# Altium project MainBoard.PrjPCB (part 2 of 2)

## Sheet Mainboard_Debug_Interface.SchDoc
size A4
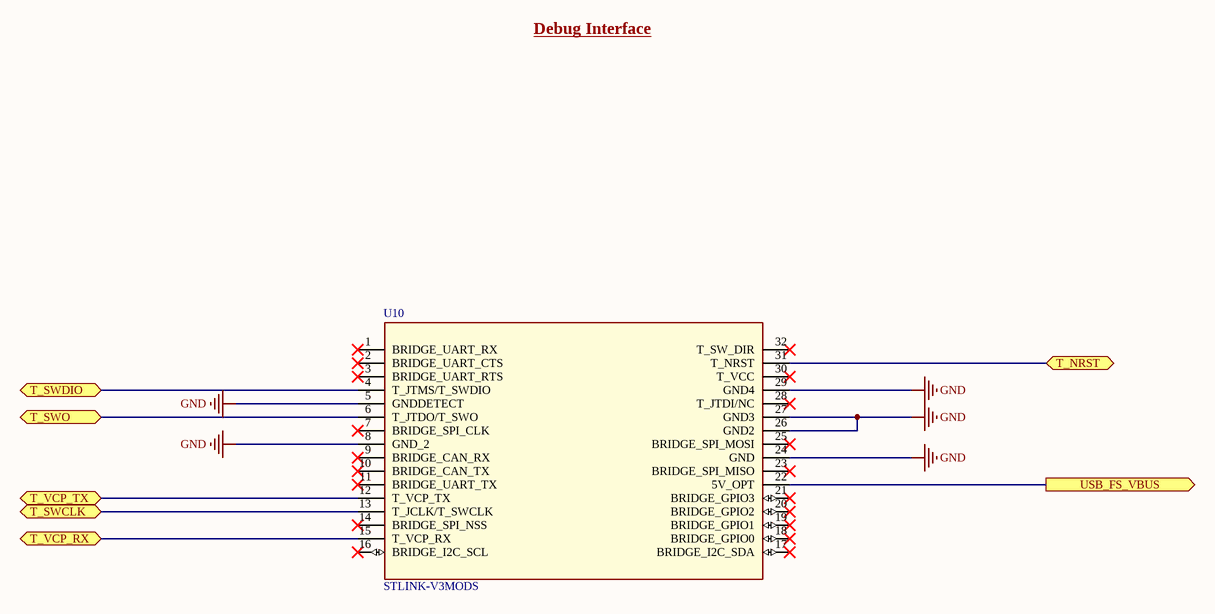
[diagram p7: Mainboard_Debug_Interface.SchDoc]

### Parts
U10  STLINK-V3MODS  [STLINK-V3MODS]

### Ports
T_NRST (bidir), T_SWCLK (bidir), T_SWDIO (bidir), T_SWO (bidir), T_VCP_RX (bidir), T_VCP_TX (bidir), USB_FS_VBUS (out)

### Nets
GND: U10.5(GNDDETECT) U10.8(GND_2) U10.24(GND) U10.26(GND2) U10.27(GND3) U10.29(GND4)
NRST: U10.31(T_NRST) ; port T_NRST
NetF1_1: U10.22(5V_OPT) ; port USB_FS_VBUS
NetU10_4: U10.4(T_JTMS/T_SWDIO) ; port T_SWDIO
NetU10_6: U10.6(T_JTDO/T_SWO) ; port T_SWO
NetU10_12: U10.12(T_VCP_TX) ; port T_VCP_TX
NetU10_13: U10.13(T_JCLK/T_SWCLK) ; port T_SWCLK
NetU10_15: U10.15(T_VCP_RX) ; port T_VCP_RX

Not connected (* = marked no-connect by the designer): U10 1(BRIDGE_UART_RX)* 2(BRIDGE_UART_CTS)* 3(BRIDGE_UART_RTS)* 7(BRIDGE_SPI_CLK)* 9(BRIDGE_CAN_RX)* 10(BRIDGE_CAN_TX)* 11(BRIDGE_UART_TX)* 14(BRIDGE_SPI_NSS)* 16(BRIDGE_I2C_SCL)* 17(BRIDGE_I2C_SDA)* 18(BRIDGE_GPIO0)* 19(BRIDGE_GPIO1)* 20(BRIDGE_GPIO2)* 21(BRIDGE_GPIO3)* 23(BRIDGE_SPI_MISO)* 25(BRIDGE_SPI_MOSI)* 28(T_JTDI/NC)* 30(T_VCC)* 32(T_SW_DIR)*

### Notes on the sheet
- Debug Interface

### Library data of the parts
U10 = STLINK-V3MODS: STM32 - Debugger, Programmer (In-Circuit/In-System); MF: STMicroelectronics; MP: STLINK-V3MODS; Price: $12.15; ComponentLink1Description: Digikey; ComponentLink1URL: https://www.digikey.ca/en/products/detail/stmicroelectronics/stlink-v3mods/11610874; ComponentLink2Description: SnapEDA; ComponentLink2URL: https://www.snapeda.com/parts/STLINK-V3MODS/STMicroelectronics/view-part/; ComponentLink3Description: Datasheet; ComponentLink3URL: https://www.st.com/resource/en/data_brief/stlink-v3mods.pdf; Digikey PN: 497-STLINK-V3MODS-ND

## Sheet Mainboard_User_Interface.SchDoc
size A4
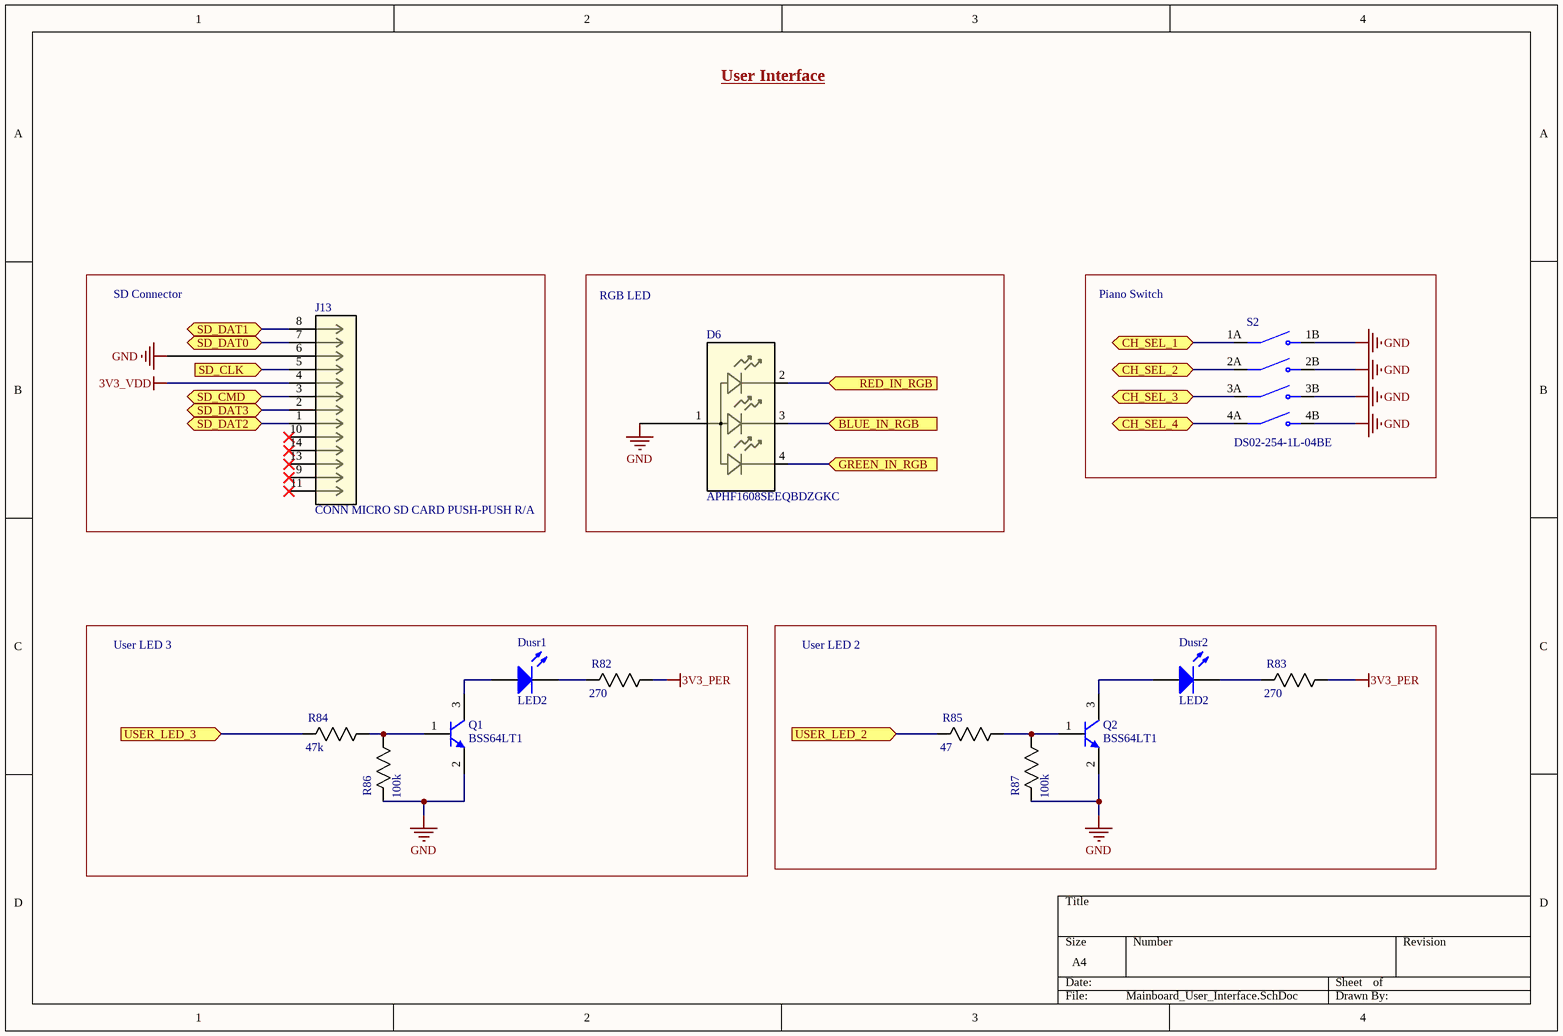
[diagram p8: Mainboard_User_Interface.SchDoc]

### Parts
D6  APHF1608SEEQBDZGKC  [LED RGB APHF1608SEEQBDZGKC_KNB-L]
Dusr1  LED2  [3.2X1.6X1.1]
Dusr2  LED2  [3.2X1.6X1.1]
J13  CONN MICRO SD CARD PUSH-PUSH R/A  [SD Connector 5027740891]
Q1  BSS64LT1  [ONSC-SOT-23-3-318-08_V]
Q2  BSS64LT1  [ONSC-SOT-23-3-318-08_V]
R82  270  [0805]
R83  270  [0805]
R84  47k  [0805]
R85  47  [0805]
R86  100k  [0805]
R87  100k  [0805]
S2  DS02-254-1L-04BE  [SW_DS02-254-1L-04BE]

### Blocks framed on the sheet
SD Connector: J13
RGB LED: D6
Piano Switch: S2
User LED 3: Dusr1 Q1 R82 R84 R86
User LED 2: Dusr2 Q2 R83 R85 R87

### Ports
BLUE_IN_RGB (in), CH_SEL_1 (bidir), CH_SEL_2 (bidir), CH_SEL_3 (bidir), CH_SEL_4 (bidir), GREEN_IN_RGB (in), RED_IN_RGB (in), SD_CLK (in), SD_CMD (bidir), SD_DAT0 (bidir), SD_DAT1 (bidir), SD_DAT2 (bidir), SD_DAT3 (bidir), USER_LED_2 (in), USER_LED_3 (in)

### Nets
3V3_PER: R82.1(R1) R83.1(R1)
3V3_VDD: J13.4
GND: D6.1 J13.6 Q1.2(E) Q2.2(E) R86.2(R2) R87.2(R2) S2.1B(NO1) S2.2B(NO2) S2.3B(NO3) S2.4B(NO4)
NetD6_2: D6.2 ; port RED_IN_RGB
NetD6_3: D6.3 ; port BLUE_IN_RGB
NetD6_4: D6.4 ; port GREEN_IN_RGB
NetDusr1_1: Dusr1.1(A) Q1.3(C)
NetDusr1_2: Dusr1.2(K) R82.2(R2)
NetDusr2_1: Dusr2.1(A) Q2.3(C)
NetDusr2_2: Dusr2.2(K) R83.2(R2)
NetJ13_1: J13.1 ; port SD_DAT2
NetJ13_2: J13.2 ; port SD_DAT3
NetJ13_3: J13.3 ; port SD_CMD
NetJ13_5: J13.5 ; port SD_CLK
NetJ13_7: J13.7 ; port SD_DAT0
NetJ13_8: J13.8 ; port SD_DAT1
NetQ1_1: Q1.1(B) R84.1(R1) R86.1(R1)
NetQ2_1: Q2.1(B) R85.1(R1) R87.1(R1)
NetR84_2: R84.2(R2) ; port USER_LED_3
NetR85_2: R85.2(R2) ; port USER_LED_2
NetS2_1A: S2.1A(COM1) ; port CH_SEL_1
NetS2_2A: S2.2A(COM2) ; port CH_SEL_2
NetS2_3A: S2.3A(COM3) ; port CH_SEL_3
NetS2_4A: S2.4A(COM4) ; port CH_SEL_4

Not connected (* = marked no-connect by the designer): J13 9* 10* 11* 13* 14*

### Notes on the sheet
- User Interface

### Library data of the parts
D6 = LED RGB CLEAR 4SMD: Red, Green, Blue (RGB) 621nm Red, 525nm Green, 465nm Blue LED Indication - Discrete 2V Red, 3.3V Green, 3.3V Blue 4-SMD, No Lead; MF: Kingbright; ComponentLink1Description: Digikey; ComponentLink1URL: https://www.digikey.com/en/products/detail/kingbright/APHF1608SEEQBDZGKC/7597099; Digikey: 754-2144-1-ND; MP: APHF1608SEEQBDZGKC; ComponentLink2Description: Datasheet; ComponentLink2URL: https://www.kingbrightusa.com/images/catalog/SPEC/APHF1608SEEQBDZGKC.pdf
Dusr1 = LED RED SMD: Typical RED, GREEN, YELLOW, AMBER GaAs LED; Lens Color: Colorless; Voltage - Forward (Vf) (Typ): 1.7V; Current - Test: 20mA; Lens Transparency: Clear; Package: 1206; Color: Red
Dusr2 = LED GREEN SMD: Typical RED, GREEN, YELLOW, AMBER GaAs LED; Voltage - Forward (Vf) (Typ): 2V; Lens Transparency: Clear; Current - Test: 20mA; Package: 1206; Color: Green
J13 = CONN MICRO SD CARD PUSH-PUSH R/A: 10 (8 + 2) Position Card Connector Secure Digital - microSD™ Surface Mount, Right Angle Gold; MF: Molex; MP: 5027740891; ComponentLink1Description: Digikey; ComponentLink1URL: https://www.digikey.ca/en/products/detail/molex/5027740891/1952536; Digikey: WM24066CT-ND; ComponentLink2Description: Datasheet; ComponentLink2URL: https://www.molex.com/pdm_docs/sd/5027740891_sd.pdf
Q1 Q2 = CMP-1048-00605-1: Driver Transistor, NPN Silicon, 3-Pin SOT-23, Tape and Reel; Manufacturer: On Semiconductor; IC Continuous (A): 0.1; fT Min (MHz): 60; ComponentLink1Description: Manufacturer URL; ComponentLink3Description: Package Specification; ComponentLink2URL: http://www.onsemi.com/pub_link/Collateral/BSS64LT1-D.PDF; ComponentLink1URL: http://www.onsemi.com/; ComponentLink2Description: Datasheet; ComponentLink3URL: http://www.onsemi.cn/pub_link/Collateral/318-08.PDF; RoHS: FALSE; PackageVersion: Rev. AP, 11/2009; Polarity: NPN; PartNumber: BSS64LT1; Mounting Technology: Surface Mount; PackageDescription: 3-Pin Small Outline Transistor, Body 2.92 x 1.3 mm, Pitch 0.95 mm; Packing: Tape and Reel; DatasheetVersion: Rev. 5; PackageReference: SOT-23-3-318-08
R82 R83 = RES 270.0 1/8W: RES SMD 270 OHM 5% 1/8W 0805; Power (Watts): 0.125W; Package: 0805; Value: 270; Tolerance: 5%
R84 = RES 47k 1/8W - 1%: RES SMD 47K OHM 1% 1/8W 0805; Power (Watts): 0.125W; Package: 0805; Value: 47k; Tolerance: 1%
R85 = RES 47.0 1/8W - 1%: RES SMD 47 OHM 1% 1/8W 0805; Power (Watts): 0.125W; Package: 0805; Value: 47; Tolerance: 1%
R86 R87 = RES 100k 1/8W - 1%: RES SMD 100K OHM 1% 1/8W 0805; Power (Watts): 0.125W; Package: 0805; Value: 100k; Tolerance: 1%
S2 = DS02-254-1L-04BE: Dip Switch Piano Key 4-position; Package: None; Price: None; Value: *; MP: DS02-254-1L-04BE; Availability: Unavailable

## Sheet Mainboard_MCU_Breakout.SchDoc
size A4
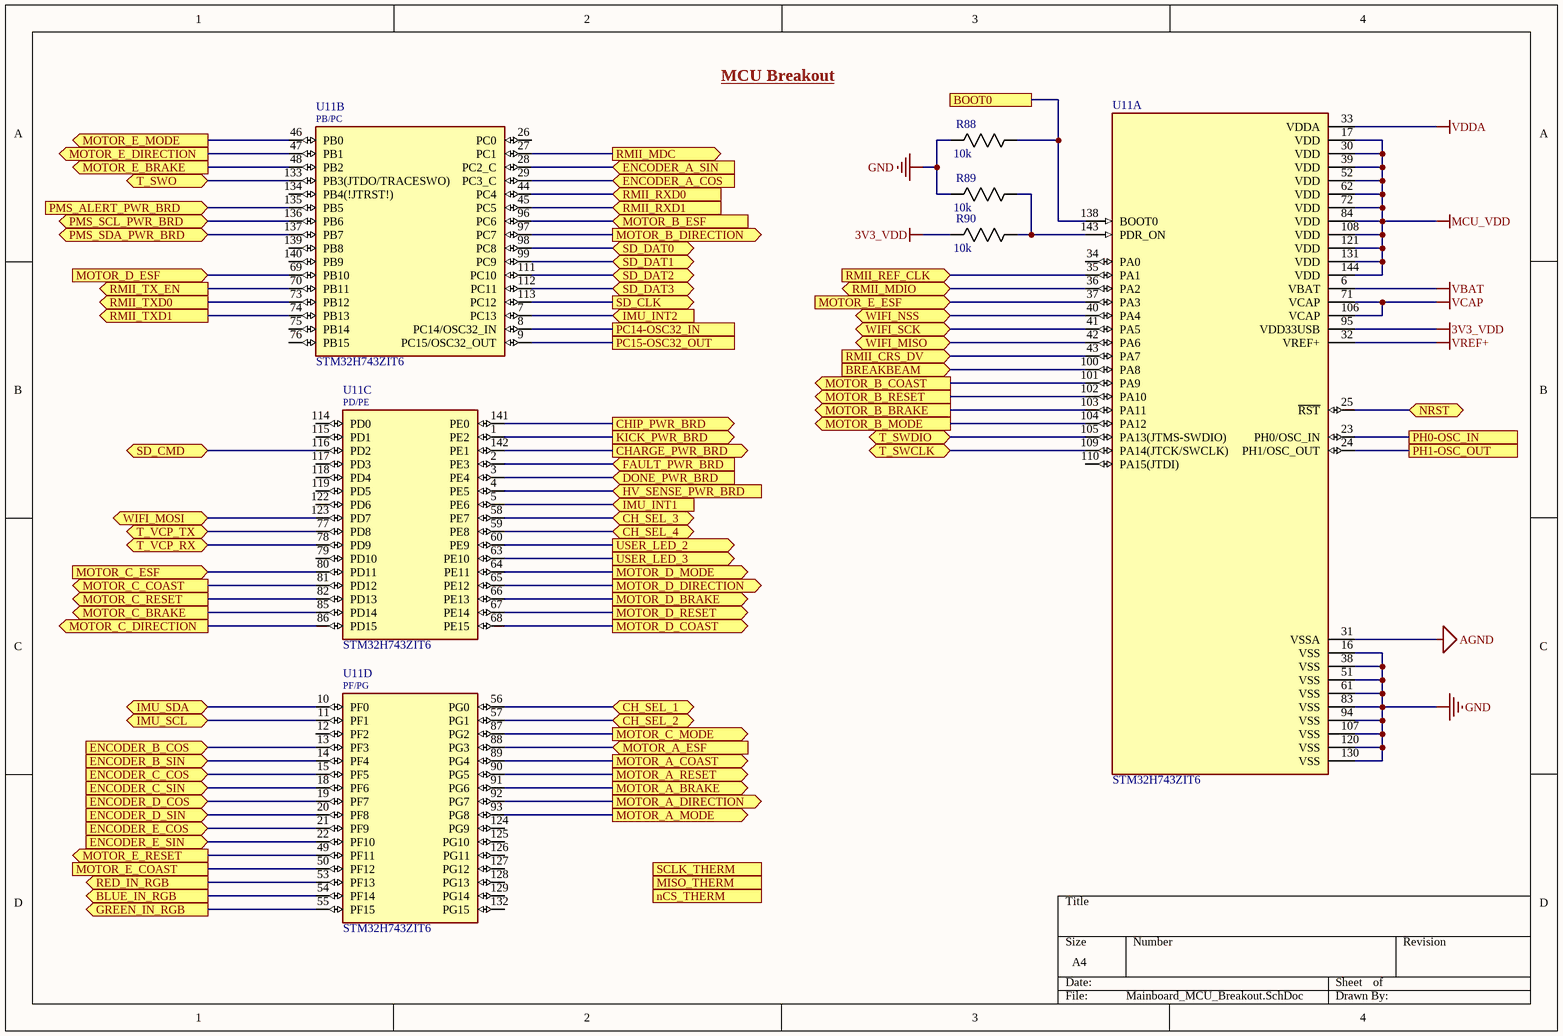
[diagram p9: Mainboard_MCU_Breakout.SchDoc]

### Parts
R88  10k  [0805]
R89  10k  [0805]
R90  10k  [0805]
U11  STM32H743ZIT6  [QFP50P2200X2200X160-144N]  (parts A,B,C,D of 4)

### Ports
BLUE_IN_RGB (out), BOOT0, BREAKBEAM (in), CH_SEL_1 (bidir), CH_SEL_2 (bidir), CH_SEL_3 (bidir), CH_SEL_4 (bidir), CHARGE_PWR_BRD (out), CHIP_PWR_BRD (out), DONE_PWR_BRD (in), ENCODER_A_COS (in), ENCODER_A_SIN (in), ENCODER_B_COS (in), ENCODER_B_SIN (in), ENCODER_C_COS (in), ENCODER_C_SIN (in), ENCODER_D_COS (in), ENCODER_D_SIN (in), ENCODER_E_COS (in), ENCODER_E_SIN (in), FAULT_PWR_BRD (in), GREEN_IN_RGB (out), HV_SENSE_PWR_BRD (in), IMU_INT1 (in), IMU_INT2 (in), IMU_SCL (bidir), IMU_SDA (bidir), KICK_PWR_BRD (out), MISO_THERM (in), MOTOR_A_BRAKE (out), MOTOR_A_COAST (out), MOTOR_A_DIRECTION (out), MOTOR_A_ESF (in), MOTOR_A_MODE (out), MOTOR_A_RESET (out), MOTOR_B_BRAKE (out), MOTOR_B_COAST (out), MOTOR_B_DIRECTION (out), MOTOR_B_ESF (in), MOTOR_B_MODE (out), MOTOR_B_RESET (out), MOTOR_C_BRAKE (out), MOTOR_C_COAST (out), MOTOR_C_DIRECTION (out), MOTOR_C_ESF (in), MOTOR_C_MODE (out), MOTOR_C_RESET (out), MOTOR_D_BRAKE (out), MOTOR_D_COAST (out), MOTOR_D_DIRECTION (out), MOTOR_D_ESF (in), MOTOR_D_MODE (out), MOTOR_D_RESET (out), MOTOR_E_BRAKE (out), MOTOR_E_COAST, MOTOR_E_DIRECTION (out), MOTOR_E_ESF (in), MOTOR_E_MODE (out), MOTOR_E_RESET (out), nCS_THERM (out), NRST (bidir), PC14-OSC32_IN, PC15-OSC32_OUT, PH0-OSC_IN, PH1-OSC_OUT, PMS_ALERT_PWR_BRD (in), PMS_SCL_PWR_BRD (bidir), PMS_SDA_PWR_BRD (bidir), RED_IN_RGB (out), RMII_CRS_DV (in), RMII_MDC (out), RMII_MDIO (bidir), RMII_REF_CLK (in), RMII_RXD0 (in), RMII_RXD1 (in), RMII_TX_EN (out), RMII_TXD0 (out), RMII_TXD1 (out), SCLK_THERM (out), SD_CLK (out), SD_CMD (bidir), SD_DAT0 (bidir), SD_DAT1 (bidir), SD_DAT2 (bidir), SD_DAT3 (bidir), T_SWCLK (bidir), T_SWDIO (bidir), T_SWO (bidir), T_VCP_RX (bidir), T_VCP_TX (bidir), USER_LED_2 (out), USER_LED_3 (out), WIFI_MISO (bidir), WIFI_MOSI (bidir), WIFI_NSS (bidir), WIFI_SCK (bidir)

### Nets
3V3_VDD: R90.2(R2) U11.95(VDD33USB)
AGND: U11.31(VSSA)
GND: R88.2(R2) R89.2(R2) U11.16(VSS) U11.38(VSS) U11.51(VSS) U11.61(VSS) U11.83(VSS) U11.94(VSS) U11.107(VSS) U11.120(VSS) U11.130(VSS)
MCU_VDD: U11.17(VDD) U11.30(VDD) U11.39(VDD) U11.52(VDD) U11.62(VDD) U11.72(VDD) U11.84(VDD) U11.108(VDD) U11.121(VDD) U11.131(VDD) U11.144(VDD)
VBAT: U11.6(VBAT)
VCAP: U11.71(VCAP) U11.106(VCAP)
VDDA: U11.33(VDDA)
VREF+: U11.32(VREF+)
Cos1: U11.13(PF3) ; port ENCODER_B_COS
Cos2: U11.29(PC3_C) ; port ENCODER_A_COS
Cos3: U11.15(PF5) ; port ENCODER_C_COS
Cos4: U11.19(PF7) ; port ENCODER_D_COS
NRST: U11.25(~{RST}) ; port NRST
PC14-OSC32_IN: U11.8(PC14/OSC32_IN) ; port PC14-OSC32_IN
PC15-OSC32_OUT: U11.9(PC15/OSC32_OUT) ; port PC15-OSC32_OUT
PH0-OSC_IN: U11.23(PH0/OSC_IN) ; port PH0-OSC_IN
PH1-OSC_OUT: U11.24(PH1/OSC_OUT) ; port PH1-OSC_OUT
RMII_MDIO: U11.36(PA2) ; port RMII_MDIO
RMII_REF_CLK: U11.35(PA1) ; port RMII_REF_CLK
RMII_TX_EN: U11.70(PB11) ; port RMII_TX_EN
RMII_TXD0: U11.73(PB12) ; port RMII_TXD0
RMII_TXD1: U11.74(PB13) ; port RMII_TXD1
Sin1: U11.14(PF4) ; port ENCODER_B_SIN
Sin2: U11.28(PC2_C) ; port ENCODER_A_SIN
Sin3: U11.18(PF6) ; port ENCODER_C_SIN
Sin4: U11.20(PF8) ; port ENCODER_D_SIN
NetD6_2: U11.53(PF13) ; port RED_IN_RGB
NetD6_3: U11.54(PF14) ; port BLUE_IN_RGB
NetD6_4: U11.55(PF15) ; port GREEN_IN_RGB
NetJ7_A17: U11.91(PG6) ; port MOTOR_A_BRAKE
NetJ7_A18: U11.88(PG3) ; port MOTOR_A_ESF
NetJ7_B15: U11.90(PG5) ; port MOTOR_A_RESET
NetJ7_B16: U11.89(PG4) ; port MOTOR_A_COAST
NetJ7_B17: U11.93(PG8) ; port MOTOR_A_MODE
NetJ7_B18: U11.92(PG7) ; port MOTOR_A_DIRECTION
NetJ8_A17: U11.85(PD14) ; port MOTOR_C_BRAKE
NetJ8_A18: U11.80(PD11) ; port MOTOR_C_ESF
NetJ8_B15: U11.82(PD13) ; port MOTOR_C_RESET
NetJ8_B16: U11.81(PD12) ; port MOTOR_C_COAST
NetJ8_B17: U11.87(PG2) ; port MOTOR_C_MODE
NetJ8_B18: U11.86(PD15) ; port MOTOR_C_DIRECTION
NetJ9_A17: U11.48(PB2) ; port MOTOR_E_BRAKE
NetJ9_A18: U11.37(PA3) ; port MOTOR_E_ESF
NetJ9_B15: U11.49(PF11) ; port MOTOR_E_RESET
NetJ9_B16: U11.50(PF12) ; port MOTOR_E_COAST
NetJ9_B17: U11.46(PB0) ; port MOTOR_E_MODE
NetJ9_B18: U11.47(PB1) ; port MOTOR_E_DIRECTION
NetJ10_A17: U11.103(PA11) ; port MOTOR_B_BRAKE
NetJ10_A18: U11.96(PC6) ; port MOTOR_B_ESF
NetJ10_B15: U11.102(PA10) ; port MOTOR_B_RESET
NetJ10_B16: U11.101(PA9) ; port MOTOR_B_COAST
NetJ10_B17: U11.104(PA12) ; port MOTOR_B_MODE
NetJ10_B18: U11.97(PC7) ; port MOTOR_B_DIRECTION
NetJ11_A17: U11.66(PE13) ; port MOTOR_D_BRAKE
NetJ11_A18: U11.69(PB10) ; port MOTOR_D_ESF
NetJ11_B15: U11.67(PE14) ; port MOTOR_D_RESET
NetJ11_B16: U11.68(PE15) ; port MOTOR_D_COAST
NetJ11_B17: U11.64(PE11) ; port MOTOR_D_MODE
NetJ11_B18: U11.65(PE12) ; port MOTOR_D_DIRECTION
NetJ12_2: U11.100(PA8) ; port BREAKBEAM
NetJ13_1: U11.111(PC10) ; port SD_DAT2
NetJ13_2: U11.112(PC11) ; port SD_DAT3
NetJ13_3: U11.116(PD2) ; port SD_CMD
NetJ13_5: U11.113(PC12) ; port SD_CLK
NetJ13_7: U11.98(PC8) ; port SD_DAT0
NetJ13_8: U11.99(PC9) ; port SD_DAT1
NetPboot1_1: R88.1(R1) U11.138(BOOT0) ; port BOOT0
NetPwifi1_3: U11.123(PD7) ; port WIFI_MOSI
NetPwifi1_4: U11.42(PA6) ; port WIFI_MISO
NetPwifi1_5: U11.40(PA4) ; port WIFI_NSS
NetPwifi1_6: U11.41(PA5) ; port WIFI_SCK
NetR63_2: U11.44(PC4) ; port RMII_RXD0
NetR64_2: U11.45(PC5) ; port RMII_RXD1
NetR66_2: U11.43(PA7) ; port RMII_CRS_DV
NetR84_2: U11.63(PE10) ; port USER_LED_3
NetR85_2: U11.60(PE9) ; port USER_LED_2
NetR89_1: R89.1(R1) R90.1(R1) U11.143(PDR_ON)
NetS2_1A: U11.56(PG0) ; port CH_SEL_1
NetS2_2A: U11.57(PG1) ; port CH_SEL_2
NetS2_3A: U11.58(PE7) ; port CH_SEL_3
NetS2_4A: U11.59(PE8) ; port CH_SEL_4
NetU8_13: U11.27(PC1) ; port RMII_MDC
NetU9_4: U11.5(PE6) ; port IMU_INT1
NetU9_9: U11.7(PC13) ; port IMU_INT2
NetU9_13: U11.11(PF1) ; port IMU_SCL
NetU9_14: U11.10(PF0) ; port IMU_SDA
NetU10_4: U11.105(PA13(JTMS-SWDIO)) ; port T_SWDIO
NetU10_6: U11.133(PB3(JTDO/TRACESWO)) ; port T_SWO
NetU10_12: U11.77(PD8) ; port T_VCP_TX
NetU10_13: U11.109(PA14(JTCK/SWCLK)) ; port T_SWCLK
NetU10_15: U11.78(PD9) ; port T_VCP_RX
NetU11_1: U11.1(PE2) ; port KICK_PWR_BRD
NetU11_2: U11.2(PE3) ; port FAULT_PWR_BRD
NetU11_3: U11.3(PE4) ; port DONE_PWR_BRD
NetU11_4: U11.4(PE5) ; port HV_SENSE_PWR_BRD
NetU11_21: U11.21(PF9) ; port ENCODER_E_COS
NetU11_22: U11.22(PF10) ; port ENCODER_E_SIN
NetU11_135: U11.135(PB5) ; port PMS_ALERT_PWR_BRD
NetU11_136: U11.136(PB6) ; port PMS_SCL_PWR_BRD
NetU11_137: U11.137(PB7) ; port PMS_SDA_PWR_BRD
NetU11_141: U11.141(PE0) ; port CHIP_PWR_BRD
NetU11_142: U11.142(PE1) ; port CHARGE_PWR_BRD

Not connected (* = marked no-connect by the designer): U11 12(PF2) 26(PC0) 34(PA0) 75(PB14) 76(PB15) 79(PD10) 110(PA15(JTDI)) 114(PD0) 115(PD1) 117(PD3) 118(PD4) 119(PD5) 122(PD6) 124(PG9) 125(PG10) 126(PG11) 127(PG12) 128(PG13) 129(PG14) 132(PG15) 134(PB4(!JTRST!)) 139(PB8) 140(PB9)

### Notes on the sheet
- MCU Breakout
- (in symbol STM32H743ZIT6, part B) PB/PC
- (in symbol STM32H743ZIT6, part C) PD/PE
- (in symbol STM32H743ZIT6, part D) PF/PG

### Library data of the parts
R88-R90 = RES 10k 1/8W - 1%: RES SMD 10K OHM 1% 1/8W 0805; Power (Watts): 0.125W; Package: 0805; Value: 10k; Tolerance: 1%
U11 = STM32H743ZIT6: ARM® Cortex®-M7 STM32H7 Microcontroller IC 32-Bit 480MHz 2MB (2M x 8) FLASH 144-LQFP (20x20); MF: STMicroelectronics; Package: LQFP-144 STMicroelectronics; MP: STM32H743ZIT6; ComponentLink1Description: SnapEDA; ComponentLink1URL: https://www.snapeda.com/parts/STM32H743ZIT6/STMicroelectronics/view-part/1041111/?ref=snap; ComponentLink2Description: DigiKey; ComponentLink2URL: https://www.digikey.ca/en/products/detail/stmicroelectronics/STM32H743ZIT6/7809238; ComponentLink3Description: Datasheet; ComponentLink3URL: https://www.st.com/resource/en/datasheet/stm32h743bi.pdf; DigiKey PN: 497-17721-ND

## Sheet Mainboard_MCU_Func.SchDoc
size A4
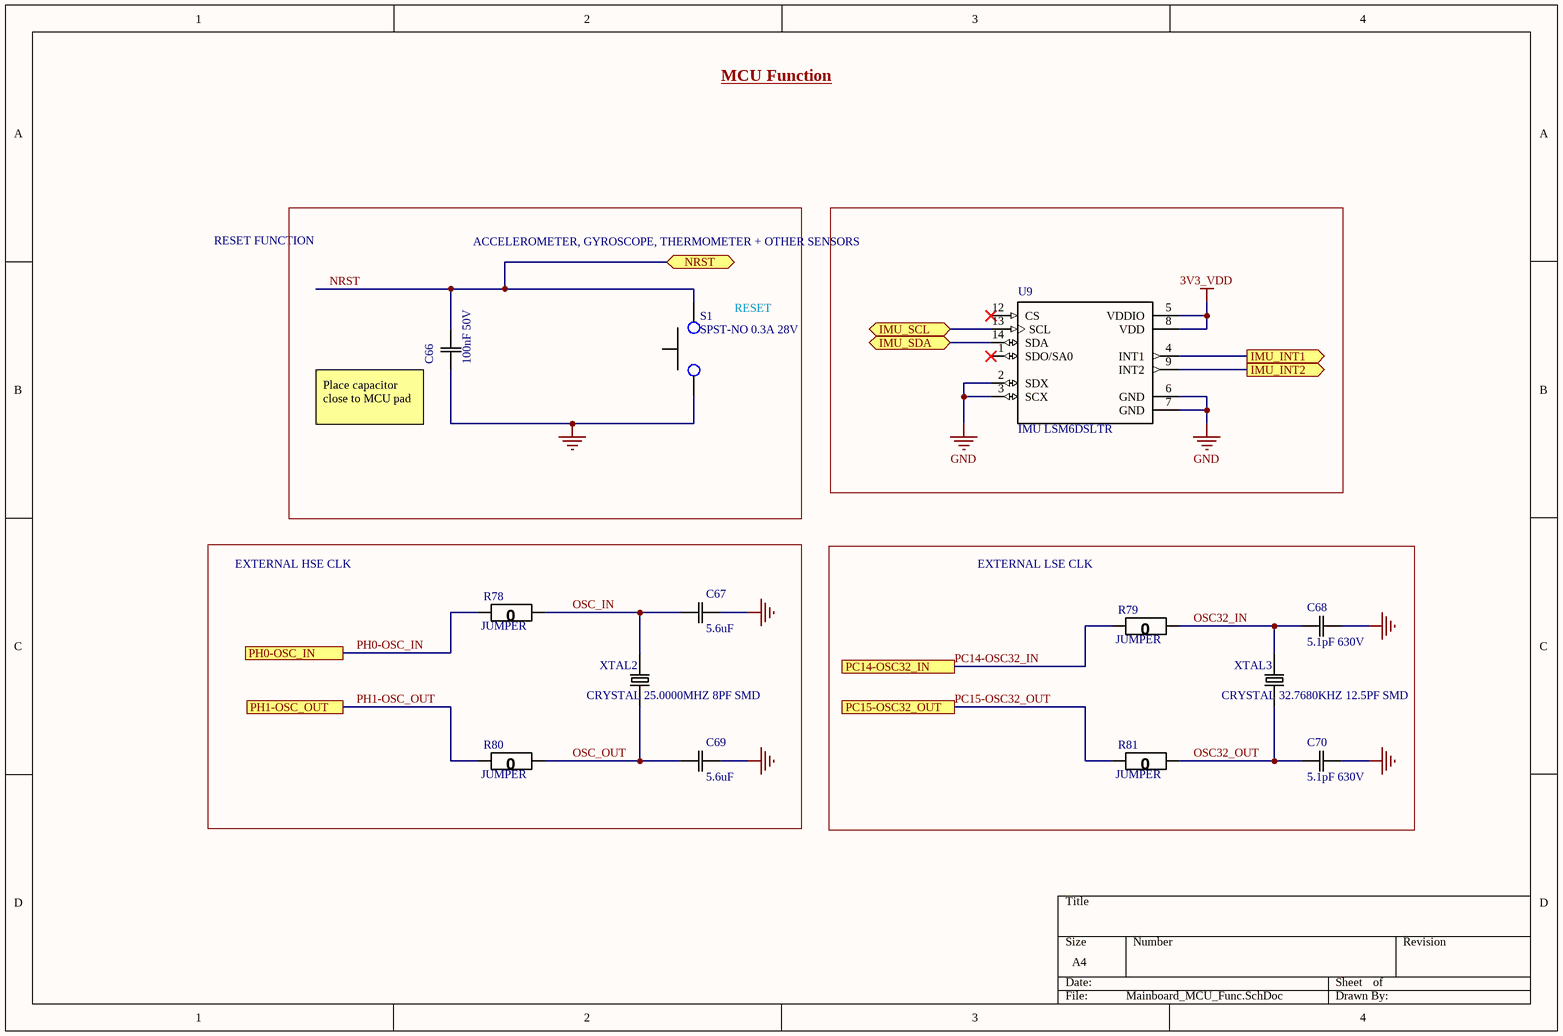
[diagram p10: Mainboard_MCU_Func.SchDoc]

### Parts
C66  100nF 50V  [0805]
C67  5.6uF  [0805]
C68  5.1pF 630V  [0805]
C69  5.6uF  [0805]
C70  5.1pF 630V  [0805]
R78  JUMPER  [0805]
R79  JUMPER  [0805]
R80  JUMPER  [0805]
R81  JUMPER  [0805]
S1  SPST-NO 0.3A 28V  [PB300STQ]
U9  IMU LSM6DSLTR  [LGA-14]
XTAL2  CRYSTAL 25.0000MHZ 8PF SMD  [SMD-2]
XTAL3  CRYSTAL 32.7680KHZ 12.5PF SMD  [SMD-2]

### Blocks framed on the sheet
ACCELEROMETER, GYROSCOPE, THERMOMETER + OTHER SENSORS: U9
EXTERNAL HSE CLK: C67 C69 R78 R80 XTAL2
EXTERNAL LSE CLK: C68 C70 R79 R81 XTAL3

### Ports
IMU_INT1 (out), IMU_INT2 (out), IMU_SCL (bidir), IMU_SDA (bidir), NRST (bidir), PC14-OSC32_IN, PC15-OSC32_OUT, PH0-OSC_IN, PH1-OSC_OUT

### Nets
3V3_VDD: U9.5(VDDIO) U9.8(VDD)
GND: C66.1(C1) C67.2(C2) C68.2(C2) C69.2(C2) C70.2(C2) S1.1 U9.2(SDX) U9.3(SCX) U9.6(GND) U9.7(GND)
NRST: C66.2(C2) S1.2 ; port NRST
OSC32_IN: C68.1(C1) R79.1(R1) XTAL3.2
OSC32_OUT: C70.1(C1) R81.1(R1) XTAL3.1
OSC_IN: C67.1(C1) R78.1(R1) XTAL2.2
OSC_OUT: C69.1(C1) R80.1(R1) XTAL2.1
PC14-OSC32_IN: R79.2(R2) ; port PC14-OSC32_IN
PC15-OSC32_OUT: R81.2(R2) ; port PC15-OSC32_OUT
PH0-OSC_IN: R78.2(R2) ; port PH0-OSC_IN
PH1-OSC_OUT: R80.2(R2) ; port PH1-OSC_OUT
NetU9_4: U9.4(INT1) ; port IMU_INT1
NetU9_9: U9.9(INT2) ; port IMU_INT2
NetU9_13: U9.13(SCL) ; port IMU_SCL
NetU9_14: U9.14(SDA) ; port IMU_SDA

Not connected (* = marked no-connect by the designer): U9 1(SDO/SA0)* 12(CS)*

### Notes on the sheet
- MCU Function
- RESET FUNCTION
- (near S1) RESET
- (near C66) Place capacitor close to MCU pad

### Library data of the parts
C66 = CAP 100nF 50V: CAP CER 0.1UF 50V X7R 0805; Tolerance: 10%; Package: 0805; Value: 100nF; Rating: 50V
C67 C69 = CAP 5.6uF 6.3V: CAP CER 5.6UF 6.3V X5R 0805; Tolerance: 10%; Package: 0805; Value: 5.6uF; Rating: 6.3V; Temperature Coefficient: X5R; Operating Temperature: -55°C ~ 85°C
C68 C70 = CAP 5.1pF 630V: CAP CER 5.1PF 630V C0G/NP0 0805; Tolerance: 10%; Rating: 50V; Package: 0805; Value: 5.1pF; Temperature Coefficient: C0G/NP0; Operating Temperature: -55°C ~ 125°C
R78-R81 = RES 0 JUMPER: RES SMD 0 OHM JUMPER GENERIC 0805; Value: 0; Package: 0805
S1 = SW PUSH NO: Pushbutton Switch SPST-NO Standard Through Hole; MF: E-Switch; Rating: 28V 0.3A; ComponentLink1Description: Digikey; ComponentLink1URL: https://www.digikey.ca/product-detail/en/e-switch/PB300STQ/EG5398-ND/6126493; ComponentLink2Description: Datasheet; ComponentLink2URL: https://sten-eswitch-13110800-production.s3.amazonaws.com/system/asset/product_line/data_sheet/222/PB300.pdf; Digikey: EG5398-ND; Digikey Link: https://www.digikey.ca/product-detail/en/e-switch/PB300STQ/EG5398-ND/6126493; MP: PB300STQ; Price: 3.40000 CAD
U9 = IMU LSM6DSLTR: IMU ACCEL/GYRO I2C/SPI 14LGA; MF: STMicroelectronics; SnapEDA_Link: https://www.snapeda.com/parts/LSM6DSLTR/STMicroelectronics/view-part/550517/?ref=snap; MP: LSM6DSLTR; Package: LGA-14 STMicroelectronics; Digikey: https://www.digikey.ca/product-detail/en/stmicroelectronics/LSM6DSLTR/497-16705-1-ND/6192805; Supplier 1: Digi-Key; Supplier Part Number 1: 497-16705-1-ND
XTAL2 = XTAL 25MHZ 8PF SMD: 25MHz ±50ppm Crystal 8pF 70 Ohms 2-SMD, No Lead; MP: NX5032GA-25.000000MHZ-LN-CD-1; MF: NDK America, Inc.; ESR: 70 Ohms; Package: 2-SMD, No Lead; Price: 0.95 CAD; Frequency: 25MHz; Digikey: 644-1041-1-ND; Digikey Link: https://www.digikey.ca/product-detail/en/ndk-america-inc/NX5032GA-25.000000MHZ-LN-CD-1/644-1041-1-ND/1128913; Load Capacitance: 8pF; Supplier 1: Digi-Key; Supplier Part Number 1: 644-1041-1-ND
XTAL3 = XTAL 32.7680KHZ 12.5PF SMD: 32.768kHz ±20ppm Crystal 12.5pF 70 kOhms 2-SMD, No Lead; MP: NX3215SA-32.768K-STD-MUA-8; MF: NDK America, Inc.; Package: 2-SMD, No Lead; Price: 1.04000 CAD; Frequency: 32.768kHz; Digikey: 644-1156-1-ND; Digikey Link: https://www.digikey.ca/en/products/detail/ndk-america-inc/NX3215SA-32-768K-STD-MUA-8/2261469?s=N4IgTCBcDaIGwBYEFoCMqCsc3IHIBEQBdAXyA; Load Capacitance: 12.5pF; ESR: 70 kOhms; ComponentLink1Description: Digikey; ComponentLink1URL: https://www.digikey.ca/en/products/detail/ndk-america-inc/NX3215SA-32-768K-STD-MUA-8/2261469; ComponentLink2Description: Datasheet; ComponentLink2URL: https://media.digikey.com/datasheets/production/702868/1/NX3215SA-32-768K-STD-MUA-8.html; Supplier 1: Digi-Key; Supplier Part Number 1: 644-1156-1-ND

## Sheet Mainboard_ThermistorAmp.SchDoc
size A
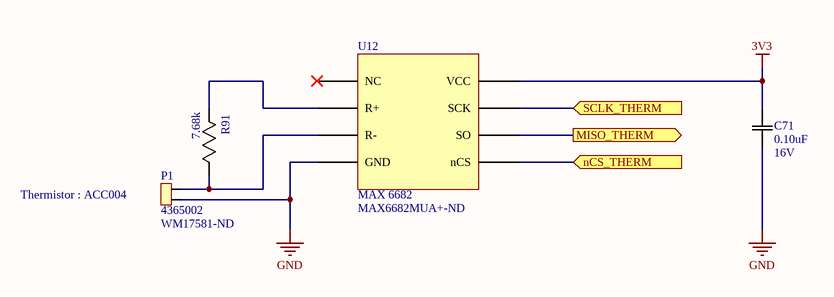
[diagram p11: Mainboard_ThermistorAmp.SchDoc]

### Parts
C71  Rating: 16V  [0603]  (hidden comment: 0.10uF)
P1  4365002  Supplier Part Number 2: WM17581-ND  [43650-02]
R91  7.68k  [0805]
U12  MAX 6682  Supplier Part Number 1: MAX6682MUA+-ND  [8-MSOP]

### Ports
MISO_THERM (out), nCS_THERM (in), SCLK_THERM (in)

### Nets
3V3: C71.1(C1) U12.8(VCC)
GND: C71.2(C2) P1.1 U12.4(GND)
NetP1_2: P1.2 R91.1(R1) U12.3(R-)
NetR91_2: R91.2(R2) U12.2(R+)
NetU12_5: U12.5(nCS) ; port nCS_THERM
NetU12_6: U12.6(SO) ; port MISO_THERM
NetU12_7: U12.7(SCK) ; port SCLK_THERM

Not connected (* = marked no-connect by the designer): U12 1(NC)*

### Notes on the sheet
- (near P1) Thermistor : ACC004

### Library data of the parts
C71 = CAP 0.10uF 16V: CAP CER 0.10UF 16V X5R 0603/0805; Tolerance: 10%; Package: 0603/0805; Temperature Coefficient: X5R; Operating Temperature: -55°C ~ 85°C; Value: 0.10uF
P1 = CN MOLEX 4365002XX: MOLEX MICROFIT 2CKT RIGHT THRU; MF: MOLEX; MP: 4365002XX; Digikey: WM17581-ND; Digikey Link: https://www.digikey.com/en/products/detail/molex/0436500205/3310532?s=N4IgTCBcDaICwGYBsBWADGsaUgLoF8g; Package: Microfit; Price: 1.44 CAD; Value: N/A; Supplier 1: Digi-Key
R91 = RES 7.68k 0.15W: RES SMD 7.68K OHM 0.1% 0.15W 0805; Power (Watts): 0.125W; Tolerance: 5%; Package: 0805; Value: 7.68k
U12 = MAX 6682: MAX 6685 Thermistor - SPI converter, 8bit; Supplier 1: Digi-Key

## Nets that join several sheets
3V3: Mainboard_Encoder_Interface (13 pins), Mainboard_Motordriver_Interface (17 pins), Mainboard_RMII_Interface (8 pins), Mainboard_Wifi_Interface (Pwifi1.7), MainBoard_MCU_Power (5 pins), Mainboard_ThermistorAmp (C71.1 U12.8)
3V3_PER: MainBoard_MCU_Power (R8.1), Mainboard_User_Interface (R82.1 R83.1)
3V3_VDD: MainBoard_MCU_Power (R5.1 R10.2), Mainboard_User_Interface (J13.4), Mainboard_MCU_Breakout (R90.2 U11.95), Mainboard_MCU_Func (U9.5 U9.8)
5V: Mainboard_Motordriver_Interface (23 pins), Mainboard_Wifi_Interface (Pwifi1.8), Mainboard_Breakbeam_Interface (J12.1), MainBoard_MCU_Power (D2.C D3.C)
AGND: MainBoard_MCU_Power (5 pins), Mainboard_MCU_Breakout (U11.31)
GND: Mainboard_Encoder_Interface (18 pins), Mainboard_Motordriver_Interface (70 pins), Mainboard_RMII_Interface (19 pins), Mainboard_Wifi_Interface (Pwifi1.1), Mainboard_Breakbeam_Interface (J12.3), MainBoard_MCU_Power (28 pins), Mainboard_Debug_Interface (6 pins), Mainboard_User_Interface (10 pins), Mainboard_MCU_Breakout (11 pins), Mainboard_MCU_Func (10 pins), Mainboard_ThermistorAmp (C71.2 P1.1 U12.4)
MCU_VDD: MainBoard_MCU_Power (15 pins), Mainboard_MCU_Breakout (11 pins)
VBAT: MainBoard_MCU_Power (C9.2 R6.1), Mainboard_MCU_Breakout (U11.6)
VCAP: MainBoard_MCU_Power (C7.2 C8.2), Mainboard_MCU_Breakout (U11.71 U11.106)
VDDA: MainBoard_MCU_Power (5 pins), Mainboard_MCU_Breakout (U11.33)
VREF+: MainBoard_MCU_Power (R3.1), Mainboard_MCU_Breakout (U11.32)
Cos1: Mainboard_Encoder_Interface (U4.7), Mainboard_MCU_Breakout (U11.13)
Cos2: Mainboard_Encoder_Interface (U2.7), Mainboard_MCU_Breakout (U11.29)
Cos3: Mainboard_Encoder_Interface (U3.7), Mainboard_MCU_Breakout (U11.15)
Cos4: Mainboard_Encoder_Interface (U5.7), Mainboard_MCU_Breakout (U11.19)
NetD6_2: Mainboard_User_Interface (D6.2), Mainboard_MCU_Breakout (U11.53)
NetD6_3: Mainboard_User_Interface (D6.3), Mainboard_MCU_Breakout (U11.54)
NetD6_4: Mainboard_User_Interface (D6.4), Mainboard_MCU_Breakout (U11.55)
NetF1_1: MainBoard_MCU_Power (F1.1), Mainboard_Debug_Interface (U10.22)
NetJ7_A17: Mainboard_Motordriver_Interface (J7.A17), Mainboard_MCU_Breakout (U11.91)
NetJ7_A18: Mainboard_Motordriver_Interface (J7.A18), Mainboard_MCU_Breakout (U11.88)
NetJ7_B15: Mainboard_Motordriver_Interface (J7.B15), Mainboard_MCU_Breakout (U11.90)
NetJ7_B16: Mainboard_Motordriver_Interface (J7.B16), Mainboard_MCU_Breakout (U11.89)
NetJ7_B17: Mainboard_Motordriver_Interface (J7.B17), Mainboard_MCU_Breakout (U11.93)
NetJ7_B18: Mainboard_Motordriver_Interface (J7.B18), Mainboard_MCU_Breakout (U11.92)
NetJ8_A17: Mainboard_Motordriver_Interface (J8.A17), Mainboard_MCU_Breakout (U11.85)
NetJ8_A18: Mainboard_Motordriver_Interface (J8.A18), Mainboard_MCU_Breakout (U11.80)
NetJ8_B15: Mainboard_Motordriver_Interface (J8.B15), Mainboard_MCU_Breakout (U11.82)
NetJ8_B16: Mainboard_Motordriver_Interface (J8.B16), Mainboard_MCU_Breakout (U11.81)
NetJ8_B17: Mainboard_Motordriver_Interface (J8.B17), Mainboard_MCU_Breakout (U11.87)
NetJ8_B18: Mainboard_Motordriver_Interface (J8.B18), Mainboard_MCU_Breakout (U11.86)
NetJ9_A17: Mainboard_Motordriver_Interface (J9.A17), Mainboard_MCU_Breakout (U11.48)
NetJ9_A18: Mainboard_Motordriver_Interface (J9.A18), Mainboard_MCU_Breakout (U11.37)
NetJ9_B15: Mainboard_Motordriver_Interface (J9.B15), Mainboard_MCU_Breakout (U11.49)
NetJ9_B16: Mainboard_Motordriver_Interface (J9.B16), Mainboard_MCU_Breakout (U11.50)
NetJ9_B17: Mainboard_Motordriver_Interface (J9.B17), Mainboard_MCU_Breakout (U11.46)
NetJ9_B18: Mainboard_Motordriver_Interface (J9.B18), Mainboard_MCU_Breakout (U11.47)
NetJ10_A17: Mainboard_Motordriver_Interface (J10.A17), Mainboard_MCU_Breakout (U11.103)
NetJ10_A18: Mainboard_Motordriver_Interface (J10.A18), Mainboard_MCU_Breakout (U11.96)
NetJ10_B15: Mainboard_Motordriver_Interface (J10.B15), Mainboard_MCU_Breakout (U11.102)
NetJ10_B16: Mainboard_Motordriver_Interface (J10.B16), Mainboard_MCU_Breakout (U11.101)
NetJ10_B17: Mainboard_Motordriver_Interface (J10.B17), Mainboard_MCU_Breakout (U11.104)
NetJ10_B18: Mainboard_Motordriver_Interface (J10.B18), Mainboard_MCU_Breakout (U11.97)
NetJ11_A17: Mainboard_Motordriver_Interface (J11.A17), Mainboard_MCU_Breakout (U11.66)
NetJ11_A18: Mainboard_Motordriver_Interface (J11.A18), Mainboard_MCU_Breakout (U11.69)
NetJ11_B15: Mainboard_Motordriver_Interface (J11.B15), Mainboard_MCU_Breakout (U11.67)
NetJ11_B16: Mainboard_Motordriver_Interface (J11.B16), Mainboard_MCU_Breakout (U11.68)
NetJ11_B17: Mainboard_Motordriver_Interface (J11.B17), Mainboard_MCU_Breakout (U11.64)
NetJ11_B18: Mainboard_Motordriver_Interface (J11.B18), Mainboard_MCU_Breakout (U11.65)
NetJ12_2: Mainboard_Breakbeam_Interface (J12.2), Mainboard_MCU_Breakout (U11.100)
NetJ13_1: Mainboard_User_Interface (J13.1), Mainboard_MCU_Breakout (U11.111)
NetJ13_2: Mainboard_User_Interface (J13.2), Mainboard_MCU_Breakout (U11.112)
NetJ13_3: Mainboard_User_Interface (J13.3), Mainboard_MCU_Breakout (U11.116)
NetJ13_5: Mainboard_User_Interface (J13.5), Mainboard_MCU_Breakout (U11.113)
NetJ13_7: Mainboard_User_Interface (J13.7), Mainboard_MCU_Breakout (U11.98)
NetJ13_8: Mainboard_User_Interface (J13.8), Mainboard_MCU_Breakout (U11.99)
NetPboot1_1: MainBoard_Top (Pboot1.1 Pboot1.2), Mainboard_MCU_Breakout (R88.1 U11.138)
NetPwifi1_3: Mainboard_Wifi_Interface (Pwifi1.3), Mainboard_MCU_Breakout (U11.123)
NetPwifi1_4: Mainboard_Wifi_Interface (Pwifi1.4), Mainboard_MCU_Breakout (U11.42)
NetPwifi1_5: Mainboard_Wifi_Interface (Pwifi1.5), Mainboard_MCU_Breakout (U11.40)
NetPwifi1_6: Mainboard_Wifi_Interface (Pwifi1.6), Mainboard_MCU_Breakout (U11.41)
NetR63_2: Mainboard_RMII_Interface (R63.2), Mainboard_MCU_Breakout (U11.44)
NetR64_2: Mainboard_RMII_Interface (R64.2), Mainboard_MCU_Breakout (U11.45)
NetR66_2: Mainboard_RMII_Interface (R66.2), Mainboard_MCU_Breakout (U11.43)
NetR84_2: Mainboard_User_Interface (R84.2), Mainboard_MCU_Breakout (U11.63)
NetR85_2: Mainboard_User_Interface (R85.2), Mainboard_MCU_Breakout (U11.60)
NetS2_1A: Mainboard_User_Interface (S2.1A), Mainboard_MCU_Breakout (U11.56)
NetS2_2A: Mainboard_User_Interface (S2.2A), Mainboard_MCU_Breakout (U11.57)
NetS2_3A: Mainboard_User_Interface (S2.3A), Mainboard_MCU_Breakout (U11.58)
NetS2_4A: Mainboard_User_Interface (S2.4A), Mainboard_MCU_Breakout (U11.59)
NetU8_13: Mainboard_RMII_Interface (U8.13), Mainboard_MCU_Breakout (U11.27)
NetU9_4: Mainboard_MCU_Breakout (U11.5), Mainboard_MCU_Func (U9.4)
NetU9_9: Mainboard_MCU_Breakout (U11.7), Mainboard_MCU_Func (U9.9)
NetU9_13: Mainboard_MCU_Breakout (U11.11), Mainboard_MCU_Func (U9.13)
NetU9_14: Mainboard_MCU_Breakout (U11.10), Mainboard_MCU_Func (U9.14)
NetU10_4: Mainboard_Debug_Interface (U10.4), Mainboard_MCU_Breakout (U11.105)
NetU10_6: Mainboard_Debug_Interface (U10.6), Mainboard_MCU_Breakout (U11.133)
NetU10_12: Mainboard_Debug_Interface (U10.12), Mainboard_MCU_Breakout (U11.77)
NetU10_13: Mainboard_Debug_Interface (U10.13), Mainboard_MCU_Breakout (U11.109)
NetU10_15: Mainboard_Debug_Interface (U10.15), Mainboard_MCU_Breakout (U11.78)
NetU11_21: Mainboard_Encoder_Interface (Um1.4), Mainboard_MCU_Breakout (U11.21)
NetU11_22: Mainboard_Encoder_Interface (Um1.5), Mainboard_MCU_Breakout (U11.22)
NRST: Mainboard_RMII_Interface (U8.15), Mainboard_Wifi_Interface (Pwifi1.2), Mainboard_Debug_Interface (U10.31), Mainboard_MCU_Breakout (U11.25), Mainboard_MCU_Func (C66.2 S1.2)
PC14-OSC32_IN: Mainboard_MCU_Breakout (U11.8), Mainboard_MCU_Func (R79.2)
PC15-OSC32_OUT: Mainboard_MCU_Breakout (U11.9), Mainboard_MCU_Func (R81.2)
PH0-OSC_IN: Mainboard_MCU_Breakout (U11.23), Mainboard_MCU_Func (R78.2)
PH1-OSC_OUT: Mainboard_MCU_Breakout (U11.24), Mainboard_MCU_Func (R80.2)
RMII_MDIO: Mainboard_RMII_Interface (R68.1 U8.12), Mainboard_MCU_Breakout (U11.36)
RMII_REF_CLK: Mainboard_RMII_Interface (R74.2), Mainboard_MCU_Breakout (U11.35)
RMII_TX_EN: Mainboard_RMII_Interface (U8.16), Mainboard_MCU_Breakout (U11.70)
RMII_TXD0: Mainboard_RMII_Interface (U8.17), Mainboard_MCU_Breakout (U11.73)
RMII_TXD1: Mainboard_RMII_Interface (U8.18), Mainboard_MCU_Breakout (U11.74)
Sin1: Mainboard_Encoder_Interface (U4.1), Mainboard_MCU_Breakout (U11.14)
Sin2: Mainboard_Encoder_Interface (U2.1), Mainboard_MCU_Breakout (U11.28)
Sin3: Mainboard_Encoder_Interface (U3.1), Mainboard_MCU_Breakout (U11.18)
Sin4: Mainboard_Encoder_Interface (U5.1), Mainboard_MCU_Breakout (U11.20)